# Altium schematic sheet voeding.SchDoc: Voeding
size A4; Date: 18/03/2022; Engineer: Benjie Van Limbergen; Revision: 1.0; SheetNumber: 4; SheetTotal: 4
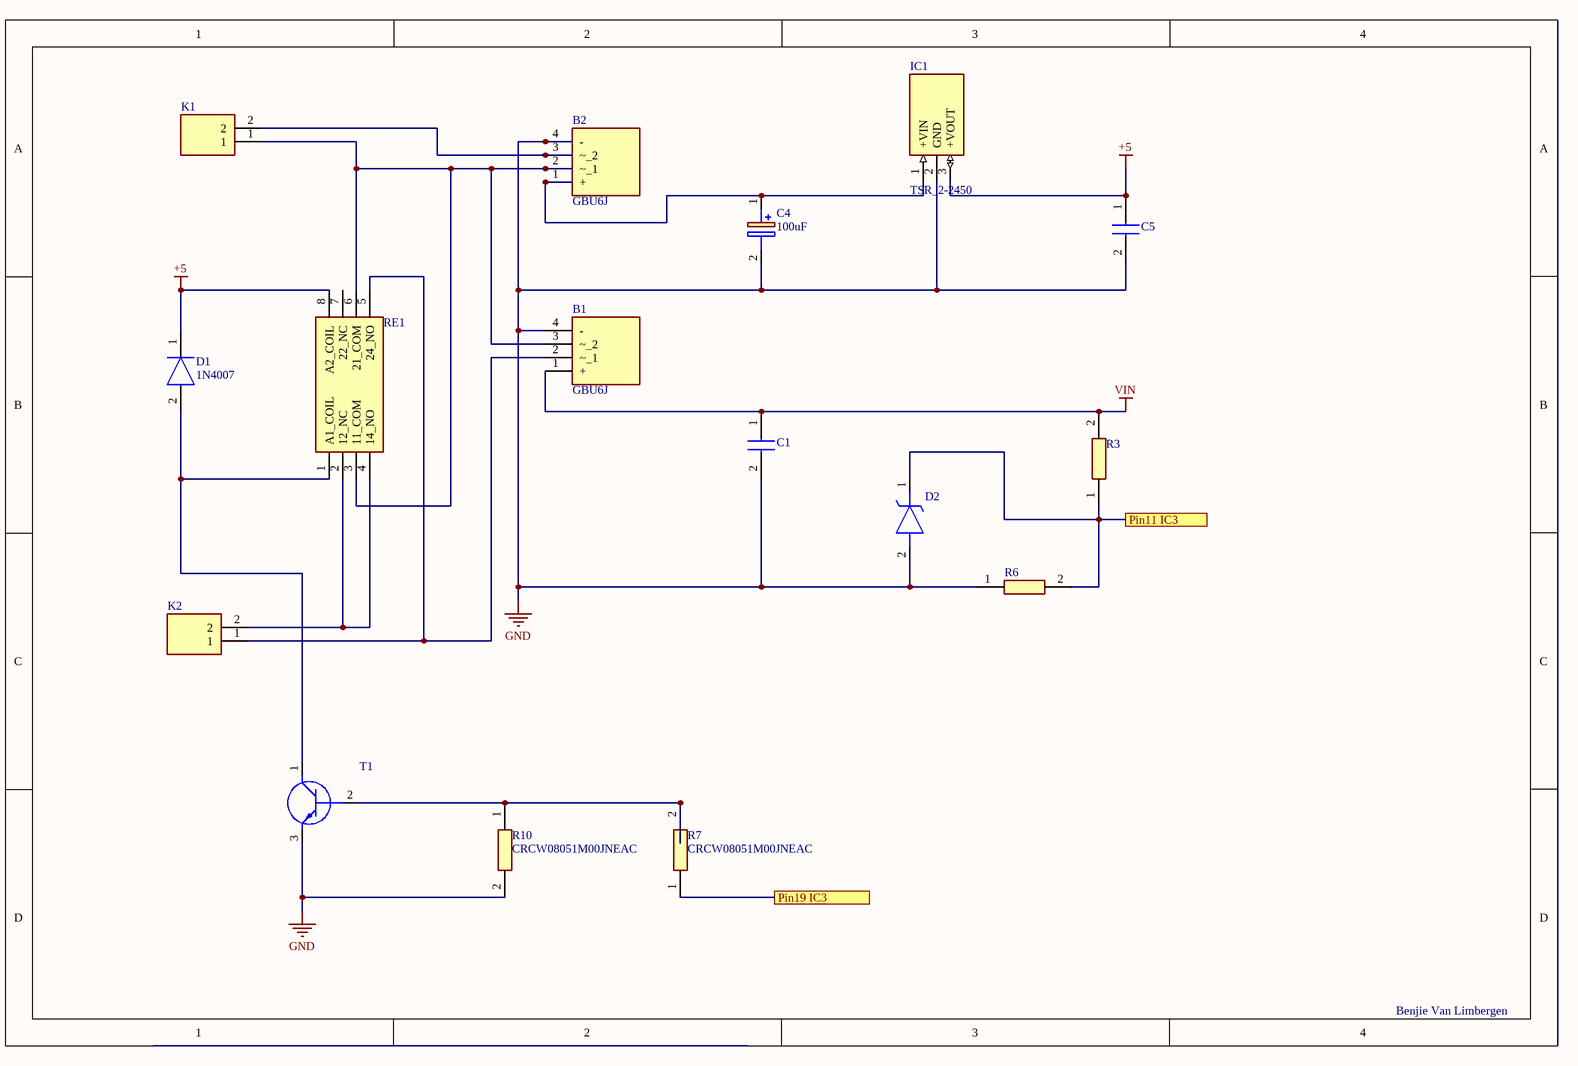
[diagram p0: voeding.SchDoc]

## Parts
B1  GBU6J  [GBU6J]
B2  GBU6J  [GBU6J]
C1  860010683032  [CAPPRD1000W80D2200H4100]  (value not drawn)
C4  100uF  [CAPPRD200W55D500H1200]
C5  860010683032  [CAPPRD200W52D500H1250]  (value not drawn)
D1  1N4007  [DIOAD1410W86L470D235]
D2  1N5231BTR  [DIOAD1068W53L380D172]  (value not drawn)
IC1  TSR_2-2450  [TSR-2]
K1  691214110002  [691214110002]  (value not drawn)
K2  691214110002  [691214110002]  (value not drawn)
R3  CRCW08051M00JNEAC  [RESC2012X60N]  (value not drawn)
R6  CRCW08051M00JNEAC  [RESC2012X60N]  (value not drawn)
R7  CRCW08051M00JNEAC  [RESC2012X60N]
R10  CRCW08051M00JNEAC  [RESC2012X60N]
RE1  RT424005  [RT42]  (value not drawn)
T1  BC547CBU  [BC547CBU]  (value not drawn)

## Ports
Pin11 IC3, Pin19 IC3

## Nets
+5: C5.1(+) D1.1(K) IC1.3(+VOUT) RE1.8(A2_COIL)
GND: B1.4(-) B2.4(-) C1.2(-) C4.2(-) C5.2(-) D2.2(A) IC1.2(GND) R6.1 R10.2 T1.3(E)
VIN: B1.1(+) C1.1(+) R3.2
Pin11 IC3: D2.1(K) R3.1 R6.2 ; port Pin11 IC3
Pin19 IC3: R7.1 ; port Pin19 IC3
NetB1_2: B1.2(~_1) K2.1 RE1.5(24_NO)
NetB1_3: B1.3(~_2) B2.2(~_1) K1.1 RE1.3(11_COM) RE1.6(21_COM)
NetB2_1: B2.1(+) C4.1(+) IC1.1(+VIN)
NetB2_3: B2.3(~_2) K1.2
NetD1_2: D1.2(A) RE1.1(A1_COIL) T1.1(C)
NetK2_2: K2.2 RE1.2(12_NC) RE1.4(14_NO)
NetR7_2: R7.2 R10.1 T1.2(B)

Not connected (* = marked no-connect by the designer): RE1 7(22_NC)

## Notes on the sheet
- Benjie Van Limbergen

## Library data of the parts
B1 B2 = GBU6J: Bridge Rectifier; Manufacturer_Name: GeneSiC Semiconductor; Datasheet Link: https://www.diodemodule.com/silicon_products/bridge_rectifiers/gbu6j.pdf; Height: 18.8mm; Manufacturer_Part_Number: GBU6J
C1 = 860010683032: Capacitor C1 4700u 50v; Manufacturer_Name: Wurth Elektronik; Datasheet Link: https://componentsearchengine.com/Datasheets/2/860010683032.pdf; Height: 41mm; Manufacturer_Part_Number: 860010683032
C4 = ECA-1HHG2R2B: Capacitor Polarised C4; Manufacturer_Name: Panasonic; Datasheet Link: http://industrial.panasonic.com/cdbs/www-data/pdf/RDF0000/ABA0000C1215.pdf; Height: 12mm; Manufacturer_Part_Number: ECA-1HHG2R2B
C5 = 860010683032: Capacitor C5; Manufacturer_Name: Wurth Elektronik; Datasheet Link: https://componentsearchengine.com/Datasheets/2/860010683032.pdf; Height: 41mm; Manufacturer_Part_Number: 860010683032
D1 = 1N4007: Diode D1; Manufacturer_Name: MULTICOMP; Datasheet Link: http://www.farnell.com/datasheets/1505911.pdf?_ga=2.248087493.396773729.1562531485-167411096.1502103357; Manufacturer_Part_Number: 1N4007
D2 = 1N5231BTR: Zener Diode D2; Manufacturer_Name: ON Semiconductor; Datasheet Link: https://componentsearchengine.com/Datasheets/1/1N5231BTR.pdf; Manufacturer_Part_Number: 1N5231BTR
IC1 = TSR_2-2450: Power Supply IC1; Manufacturer_Name: Traco Power; Manufacturer_Part_Number: TSR 2-2450; Datasheet Link: https://componentsearchengine.com//TSR 2-2450.pdf; Mouser2 Part Number: 495-TSR2-2450; Mouser2 Price/Stock: https://www.mouser.com/Search/Refine.aspx?Keyword=495-TSR2-2450
K1 K2 = 691214110002: Connector; Manufacturer_Name: Wurth Elektronik; Height: 8.7mm; Manufacturer_Part_Number: 691214110002
R3 R6 R7 R10 = CRCW08051M00JNEAC: Resistor R1-22; Manufacturer_Name: Vishay; Datasheet Link: https://componentsearchengine.com//CRCW08051M00JNEAC.pdf; Height: 0.6mm; Mouser2 Part Number: 71-CRCW08051M00JNEAC; Mouser2 Price/Stock: https://www.mouser.com/Search/Refine.aspx?Keyword=71-CRCW08051M00JNEAC; Manufacturer_Part_Number: CRCW08051M00JNEAC
RE1 = RT424005: Relay or Contactor; Manufacturer_Name: TE Connectivity; Datasheet Link: https://componentsearchengine.com//RT424005.pdf; Mouser2 Part Number: 655-RT424005; Mouser2 Price/Stock: https://www.mouser.com/Search/Refine.aspx?Keyword=655-RT424005; Manufacturer_Part_Number: RT424005
T1 = BC547CBU: Transistor BJT NPN; Manufacturer_Name: ON Semiconductor; Datasheet Link: https://www.onsemi.com/pdf/datasheet/bc550-d.pdf; Height: 5.33mm; Manufacturer_Part_Number: BC547CBU